# Altium project omni_wheel_car.PrjPcb
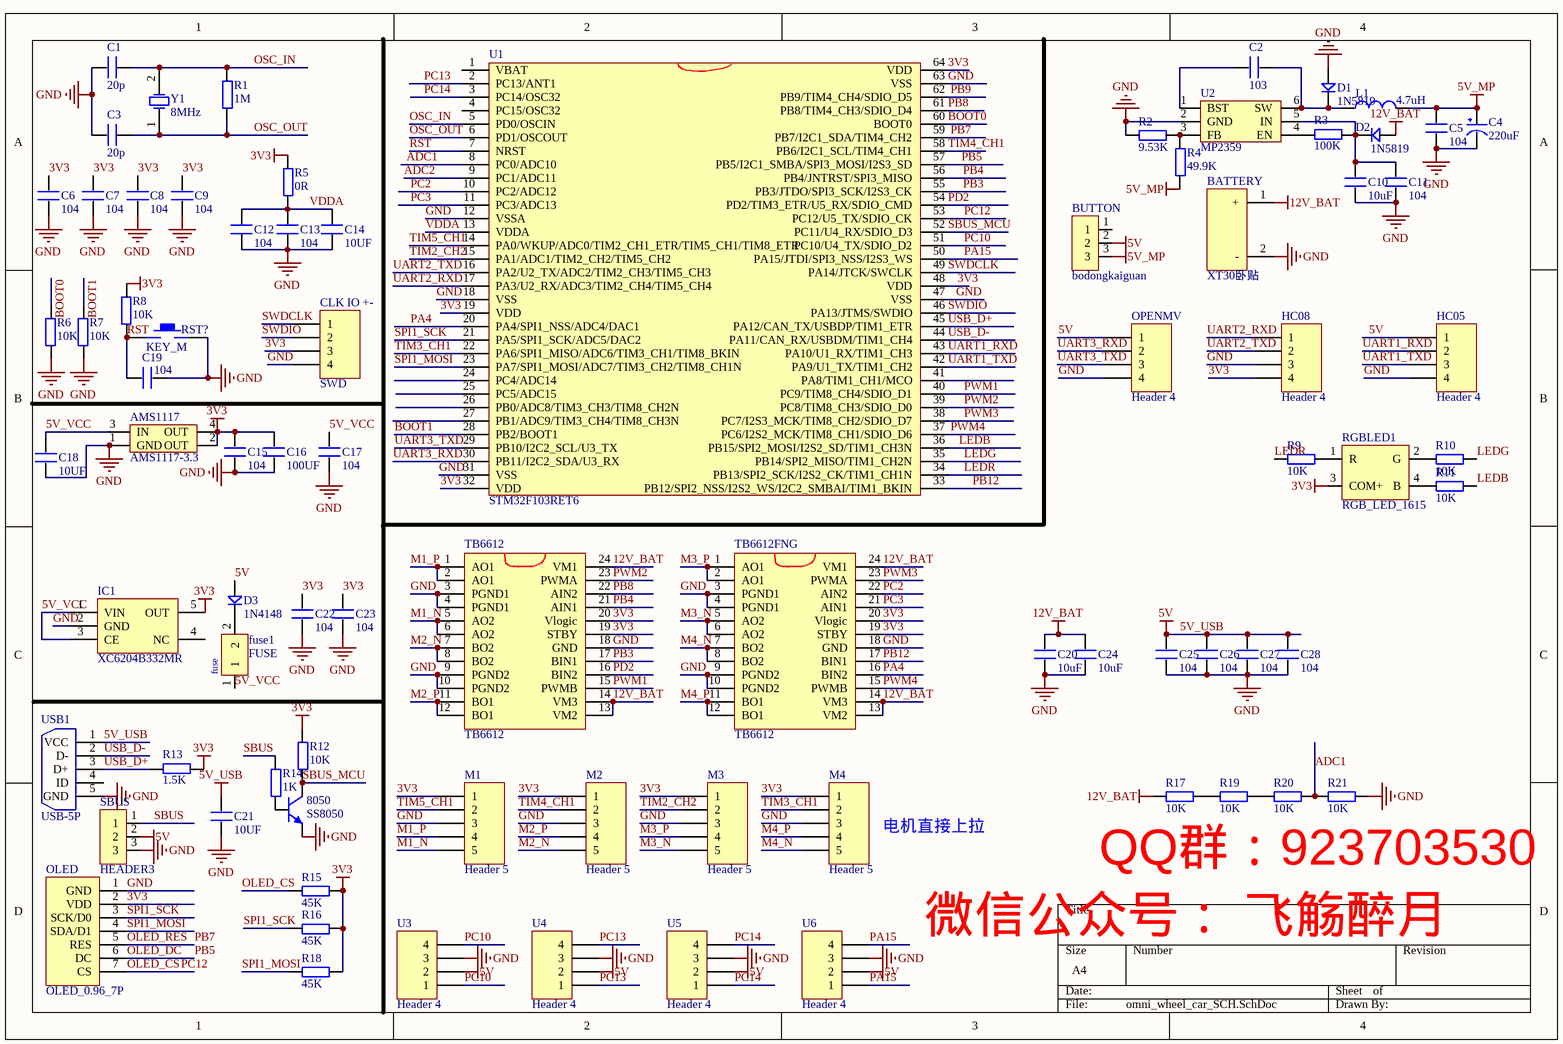
[diagram p0: omni_wheel_car_SCH.SchDoc]
1 sheet, 81 parts. Net scope: global (net labels, ports and power ports of the same name join across sheets).
Board files: logo.PcbDoc, omni_wheel_car_PCB.PcbDoc

## Sheet omni_wheel_car_SCH.SchDoc
size A4; PageSetup: Record=PageOptions|CenterHorizontal=True|CenterVertical=True|PrintScale=1.00|XCorrection=1.00|YCorrection=1.00|PrintKind=0|BorderSize=5000000|LeftOffset=0|BottomOffset=0|Orientation=2|PaperLength=1000|PaperWidth=1000|Scale=100|PaperSource=7|PrintQuality=-3|MediaType=1|DitherType=10|PrintScaleMode=1|PaperKind=A4|PaperIndex=9

### Parts
8050  SS8050  [SOT23-3L]
AMS1117  AMS1117-3.3  [AMS1117]
BATTERY  XT30卧贴  [XT30卧贴]
BUTTON  bodongkaiguan  [HDR1X3]
C1  20p  [0603P]
C2  103  [0603P]
C3  20p  [0603P]
C4  220uF  [CC6.56.5]
C5  104  [0603P]
C6  104  [0603P]
C7  104  [0603P]
C8  104  [0603P]
C9  104  [0603P]
C10  10uF  [1206]
C11  104  [0603P]
C12  104  [0603P]
C13  104  [0603P]
C14  10UF  [0603P]
C15  104  [0603P]
C16  100UF  [0603P]
C17  104  [0603P]
C18  10UF  [0603P]
C19  104  [0603P]
C20  10uF  [0805]
C21  10UF  [0603P]
C22  104  [0603P]
C23  104  [0603P]
C24  10uF  [0805]
C25  104  [0603P]
C26  104  [0603P]
C27  104  [0603P]
C28  104  [0603P]
CLK_IO_+-  SWD  [SH1.0-4P]
D1  1N5819  [SOD-323]
D2  1N5819  [SOD-323]
D3  1N4148  [SOD-323]
fuse1  FUSE  [0603P]
HC05  Header 4  [GH1.25-4P]
HC08  Header 4  [HDR1X4]
IC1  XC6204B332MR  [SOT23-5L]
L1  value 4.7uH  [L__1210]  (hidden comment: Inductor)
M1  Header 5  [PH2.0卧贴5P]
M2  Header 5  [PH2.0卧贴5P]
M3  Header 5  [PH2.0卧贴5P]
M4  Header 5  [PH2.0卧贴5P]
OLED  OLED_0.96_7P  [OLED_7P]
OPENMV  Header 4  [GH1.25-4P]
R1  1M  [0603P]
R2  9.53K  [0603P]
R3  100K  [0603P]
R4  49.9K  [0603P]
R5  0R  [0603P]
R6  10K  [0603P]
R7  10K  [0603P]
R8  10K  [0603P]
R9  10K  [0603P]
R10  10K  [0603P]
R11  10K  [0603P]
R12  10K  [0603P]
R13  1.5K  [0603P]
R14  1K  [0603P]
R15  45K  [0603P]
R16  45K  [0603P]
R17  10K  [0603P]
R18  45K  [0603P]
R19  10K  [0603P]
R20  10K  [0603P]
R21  10K  [0603P]
RGBLED1  RGB_LED_1615  [RGB_LED_1615]
RST?  KEY_M  [KEY_SOP3625]
SBUS  HEADER3  [HDR1X3]
TB6612  TB6612  [ssop24]
TB6612FNG  TB6612  [ssop24]
U1  STM32F103RET6  [STM-LQFP64_M]
U2  MP2359  [SOT-23-6]
U3  Header 4  [HDR1X4]
U4  Header 4  [HDR1X4]
U5  Header 4  [HDR1X4]
U6  Header 4  [HDR1X4]
USB1  USB-5P  [MICRO_USB]
Y1  8MHz  [5032]

### Nets
3V3: AMS1117.2(OUT) AMS1117.4(OUT) C6.2 C7.2 C8.2 C9.2 C15.2 C16.2 C22.2 C23.2 CLK_IO_+-.3 HC08.4 IC1.5(OUT) M1.1 M2.1 M3.1 M4.1 OLED.2(VDD) R5.2 R8.1 R12.2 R13.1 R15.2 R16.2 R18.2 RGBLED1.3(COM+) TB6612.19(STBY) TB6612.20(Vlogic) TB6612FNG.19(STBY) TB6612FNG.20(Vlogic) U1.19(VDD) U1.32(VDD) U1.48(VDD) U1.64(VDD)
5V: BUTTON.2 C21.2 C25.2 C26.2 C27.2 C28.2 D3.1 HC05.1 OPENMV.1 SBUS.2 U3.2 U4.2 U5.2 U6.2 USB1.1(VCC)  [also labelled 5V_USB]
5V_MP: BUTTON.3 C4.1(VCC) C5.2 L1.2 R4.1
12V_BAT: BATTERY.1(+) C20.2 C24.2 D2.1 R17.1 TB6612.13(VM2) TB6612.14(VM3) TB6612.24(VM1) TB6612FNG.13(VM2) TB6612FNG.14(VM3) TB6612FNG.24(VM1)
GND: 8050.2(E) AMS1117.1(GND) BATTERY.2(-) C1.1 C3.1 C4.2(GND) C5.1 C6.1 C7.1 C8.1 C9.1 C10.1 C11.1 C12.1 C13.1 C14.1 C15.1 C16.1 C17.1 C18.1 C19.1 C20.1 C21.1 C22.1 C23.1 C24.1 C25.1 C26.1 C27.1 C28.1 CLK_IO_+-.4 D1.1 HC05.4 HC08.3 IC1.2(GND) M1.3 M2.3 M3.3 M4.3 OLED.1(GND) OPENMV.4 R2.1 R6.2 R7.2 R21.2 RST?.2 SBUS.3 TB6612.3(PGND1) TB6612.4(PGND1) TB6612.9(PGND2) TB6612.10(PGND2) TB6612.18(GND) TB6612FNG.3(PGND1) TB6612FNG.4(PGND1) TB6612FNG.9(PGND2) TB6612FNG.10(PGND2) TB6612FNG.18(GND) U1.12(VSSA) U1.18(VSS) U1.31(VSS) U1.47(VSS) U1.63(VSS) U2.2(GND) U3.3 U4.3 U5.3 U6.3 USB1.5(GND)
5V_VCC: AMS1117.3(IN) C17.2 C18.2 fuse1.1 IC1.1(VIN) IC1.3(CE)
ADC1: R20.2 R21.1 U1.8(PC0/ADC10)
ADC2: U1.9(PC1/ADC11)
BOOT0: R6.1 U1.60(BOOT0)
BOOT1: R7.1 U1.28(PB2/BOOT1)
LEDB: R11.2 U1.36(PB15/SPI2_MOSI/I2S2_SD/TIM1_CH3N)
LEDG: R10.2 U1.35(PB14/SPI2_MISO/TIM1_CH2N)
LEDR: R9.1 U1.34(PB13/SPI2_SCK/I2S2_CK/TIM1_CH1N)
M1_N: M1.5 TB6612.5(AO2) TB6612.6(AO2)
M1_P: M1.4 TB6612.1(AO1) TB6612.2(AO1)
M2_N: M2.5 TB6612.7(BO2) TB6612.8(BO2)
M2_P: M2.4 TB6612.11(BO1) TB6612.12(BO1)
M3_N: M3.5 TB6612FNG.5(AO2) TB6612FNG.6(AO2)
M3_P: M3.4 TB6612FNG.1(AO1) TB6612FNG.2(AO1)
M4_N: M4.5 TB6612FNG.7(BO2) TB6612FNG.8(BO2)
M4_P: M4.4 TB6612FNG.11(BO1) TB6612FNG.12(BO1)
OLED_CS: OLED.7(CS) R15.1 U1.53(PC12/U5_TX/SDIO_CK)  [also labelled PC12]
OLED_DC: OLED.6(DC) U1.57(PB5/I2C1_SMBA/SPI3_MOSI/I2S3_SD)  [also labelled PB5]
OLED_RES: OLED.5(RES) U1.59(PB7/I2C1_SDA/TIM4_CH2)  [also labelled PB7]
OSC_IN: C1.2 R1.2 U1.5(PD0/OSCIN) Y1.2(OSC2)
OSC_OUT: C3.2 R1.1 U1.6(PD1/OSCOUT) Y1.1(OSC1)
PA4: TB6612FNG.16(BIN2) U1.20(PA4/SPI1_NSS/ADC4/DAC1)
PA15: U1.50(PA15/JTDI/SPI3_NSS/I2S3_WS) U6.1 U6.4
PB3: TB6612.17(BIN1) U1.55(PB3/JTDO/SPI3_SCK/I2S3_CK)
PB4: TB6612.21(AIN1) U1.56(PB4/JNTRST/SPI3_MISO)
PB8: TB6612.22(AIN2) U1.61(PB8/TIM4_CH3/SDIO_D4)
PB9: U1.62(PB9/TIM4_CH4/SDIO_D5)
PB12: TB6612FNG.17(BIN1) U1.33(PB12/SPI2_NSS/I2S2_WS/I2C2_SMBAI/TIM1_BKIN)
PC2: TB6612FNG.22(AIN2) U1.10(PC2/ADC12)
PC3: TB6612FNG.21(AIN1) U1.11(PC3/ADC13)
PC10: U1.51(PC10/U4_TX/SDIO_D2) U3.1 U3.4
PC13: U1.2(PC13/ANT1) U4.1 U4.4
PC14: U1.3(PC14/OSC32) U5.1 U5.4
PD2: TB6612.16(BIN2) U1.54(PD2/TIM3_ETR/U5_RX/SDIO_CMD)
PWM1: TB6612.15(PWMB) U1.40(PC9/TIM8_CH4/SDIO_D1)
PWM2: TB6612.23(PWMA) U1.39(PC8/TIM8_CH3/SDIO_D0)
PWM3: TB6612FNG.23(PWMA) U1.38(PC7/I2S3_MCK/TIM8_CH2/SDIO_D7)
PWM4: TB6612FNG.15(PWMB) U1.37(PC6/I2S2_MCK/TIM8_CH1/SDIO_D6)
RST: C19.2 R8.2 RST?.1 U1.7(NRST)
SBUS: R14.2 SBUS.1
SBUS_MCU: 8050.3(C) R12.1 U1.52(PC11/U4_RX/SDIO_D3)
SPI1_MOSI: OLED.4(SDA/D1) R18.1 U1.23(PA7/SPI1_MOSI/ADC7/TIM3_CH2/TIM8_CH1N)
SPI1_SCK: OLED.3(SCK/D0) R16.1 U1.21(PA5/SPI1_SCK/ADC5/DAC2)
SWDCLK: CLK_IO_+-.1 U1.49(PA14/JTCK/SWCLK)
SWDIO: CLK_IO_+-.2 U1.46(PA13/JTMS/SWDIO)
TIM2_CH2: M3.2 U1.15(PA1/ADC1/TIM2_CH2/TIM5_CH2)
TIM3_CH1: M4.2 U1.22(PA6/SPI1_MISO/ADC6/TIM3_CH1/TIM8_BKIN)
TIM4_CH1: M2.2 U1.58(PB6/I2C1_SCL/TIM4_CH1)
TIM5_CH1: M1.2 U1.14(PA0/WKUP/ADC0/TIM2_CH1_ETR/TIM5_CH1/TIM8_ETR)
UART1_RXD: HC05.2 U1.43(PA10/U1_RX/TIM1_CH3)
UART1_TXD: HC05.3 U1.42(PA9/U1_TX/TIM1_CH2)
UART2_RXD: HC08.1 U1.17(PA3/U2_RX/ADC3/TIM2_CH4/TIM5_CH4)
UART2_TXD: HC08.2 U1.16(PA2/U2_TX/ADC2/TIM2_CH3/TIM5_CH3)
UART3_RXD: OPENMV.2 U1.30(PB11/I2C2_SDA/U3_RX)
UART3_TXD: OPENMV.3 U1.29(PB10/I2C2_SCL/U3_TX)
USB_D+: R13.2 U1.45(PA12/CAN_TX/USBDP/TIM1_ETR) USB1.3(D+)
USB_D-: U1.44(PA11/CAN_RX/USBDM/TIM1_CH4) USB1.2(D-)
VDDA: C12.2 C13.2 C14.2 R5.1 U1.13(VDDA)
Net8050_1: 8050.1(B) R14.1
NetC2_1: C2.1 D1.2 L1.1 U2.6(SW)
NetC2_2: C2.2 U2.1(BST)
NetC10_2: C10.2 C11.2 D2.2 R3.1 U2.5(IN)
NetD3_2: D3.2 fuse1.2
NetR2_2: R2.2 R4.2 U2.3(FB)
NetR3_2: R3.2 U2.4(EN)
NetR9_2: R9.2 RGBLED1.1(R)
NetR10_1: R10.1 RGBLED1.2(G)
NetR11_1: R11.1 RGBLED1.4(B)
NetR17_2: R17.2 R19.1
NetR19_2: R19.2 R20.1

Not connected (* = marked no-connect by the designer): BUTTON 1; IC1 4(NC); U1 1(VBAT) 4(PC15/OSC32) 24(PC4/ADC14) 25(PC5/ADC15) 26(PB0/ADC8/TIM3_CH3/TIM8_CH2N) 27(PB1/ADC9/TIM3_CH4/TIM8_CH3N) 41(PA8/TIM1_CH1/MCO); USB1 4(ID)

### Notes on the sheet
- 电机直接上拉
- QQ群：923703530
- 微信公众号： 飞觞醉月
- (in symbol FUSE) fuse

### Library data of the parts
8050 = 8050-SMD: 高频放大-NPN型; 版权归属: 源创客; 属性: 40V 1.5A 1W 100MHZ; BOM名称: 高频放大-NPN型; 学习资源: www.ooocke.com
AMS1117 = AMS1117
C1-C3 C5 C10-C14 C20 C24 = C
C4 = CAP
C6-C9 C15-C19 C21-C23 C25-C28 = C_1
CLK_IO_+- HC05 HC08 OPENMV U3-U6 = Header 4: Header, 4-Pin; LatestRevisionDate: 17-Jul-2002; LatestRevisionNote: Re-released for DXP Platform.; Publisher: Altium Limited
D1-D3 = D
IC1 = LDO XC6204: LDO; BOM名称: 稳压芯片; 版权归属: 源创客; 学习资源: www.ooocke.com
L1 = Inductor: 电感; Code_IEC: 1005; Published: 8-Jun-2000; LatestRevisionDate: 17-Jul-2002; LatestRevisionNote: Re-released for DXP Platform.; PackageReference: 0402-A; Publisher: Altium Limited; Code_JEITA: 0402
M1-M4 = Header 5: Header, 5-Pin; LatestRevisionDate: 17-Jul-2002; LatestRevisionNote: Re-released for DXP Platform.; Publisher: Altium Limited
R1 = R_1
R2-R21 = R
SBUS = bodongkaiguan
TB6612 TB6612FNG = TB6612FNG: Motor driver with 2 H bridge
U2 = MP2359: DC DC Step Down IC
USB1 = USB-5P: 微型USB母座; 版权归属: 源创客; BOM名称: 微型USB母座; 学习资源: www.ooocke.com
Y1 = XTAL: Crystal Oscillator; Published: 8-Jun-2000; LatestRevisionDate: 17-Jul-2002; LatestRevisionNote: Re-released for DXP Platform.; Publisher: Altium Limited